# Altium schematic sheet drv8301.SchDoc
size A4; SheetNumber: 4; SheetTotal: 8
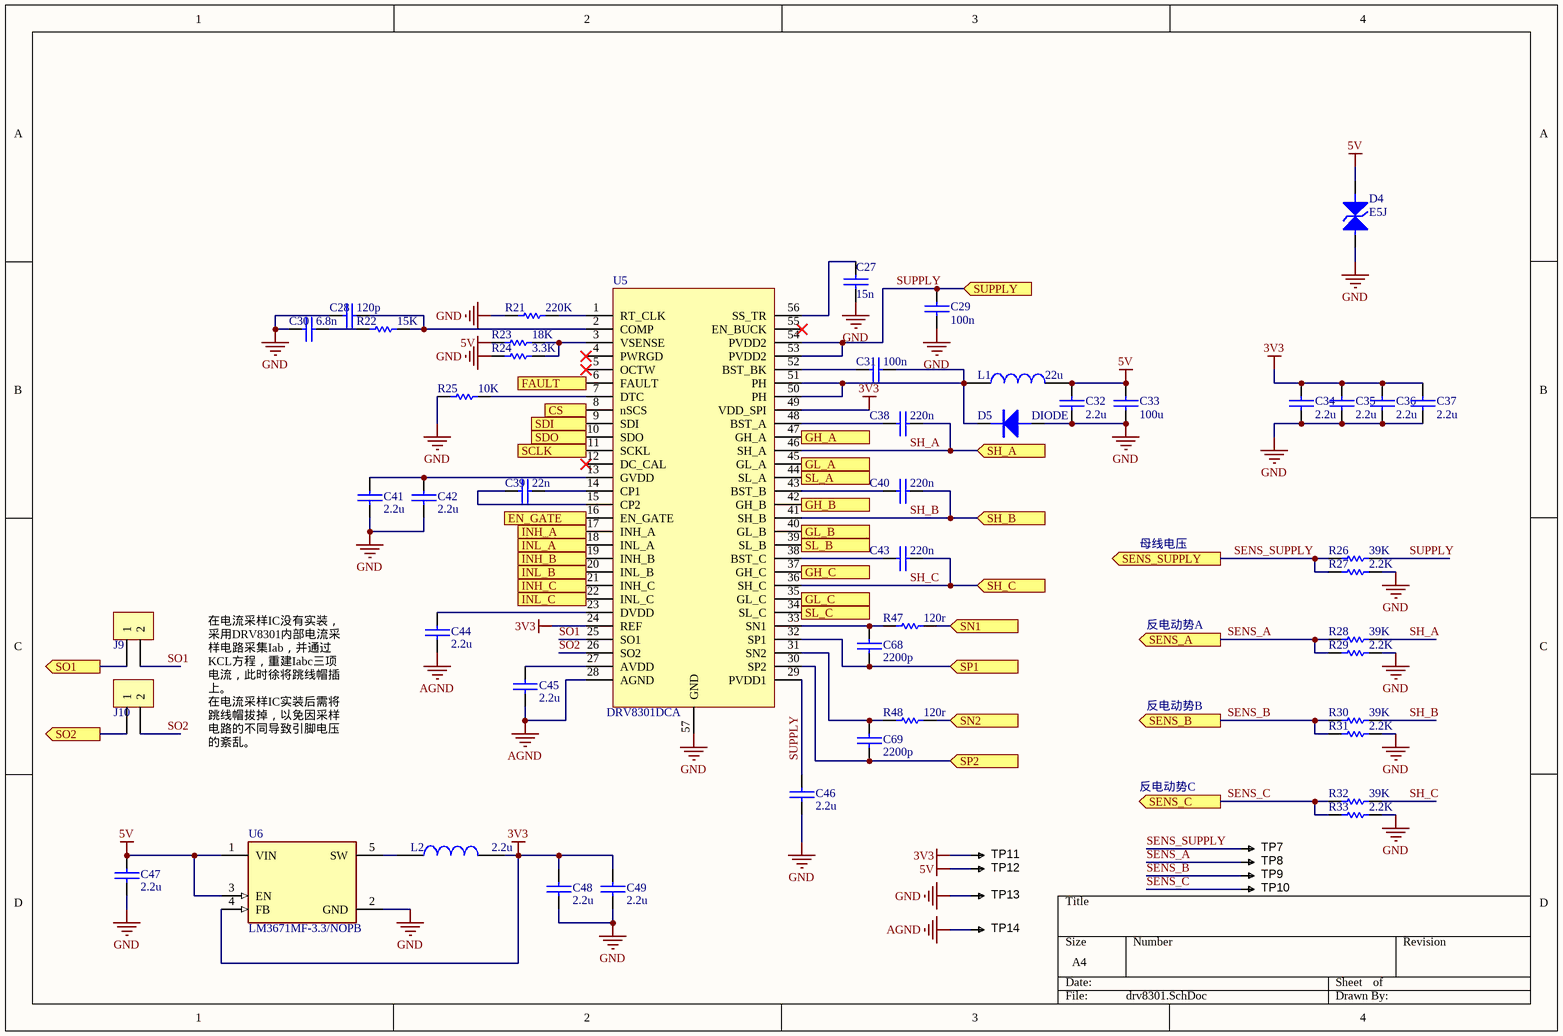
[diagram p0: drv8301.SchDoc]

## Parts
C27  15n  [0603C]
C28  120p  [0603C]
C29  100n  [0603C]
C30  6.8n  [0603C]
C31  100n  [0603C]
C32  2.2u  [0603C]
C33  100u  [0603C]
C34  2.2u  [0603C]
C35  2.2u  [0603C]
C36  2.2u  [0603C]
C37  2.2u  [0603C]
C38  220n  [0603C]
C39  22n  [0603C]
C40  220n  [0603C]
C41  2.2u  [0603C]
C42  2.2u  [0603C]
C43  220n  [0603C]
C44  2.2u  [0603C]
C45  2.2u  [0603C]
C46  2.2u  [0603C]
C47  2.2u  [0603C]
C48  2.2u  [0603C]
C49  2.2u  [0603C]
C68  2200p  [0603C]
C69  2200p  [0603C]
D4  E5J  [SOD-123]
D5  DIODE  [SMA/DO-214AC]
J9  Pin HDR1X2  [Pin HDR1X2/2.54mm-S]  (value not drawn)
J10  Pin HDR1X2  [Pin HDR1X2/2.54mm-S]  (value not drawn)
L1  22u  [0630L]
L2  2.2u  [0630L]
R21  220K  [0603R]
R22  15K  [0603R]
R23  18K  [0603R]
R24  3.3K  [0603R]
R25  10K  [0603R]
R26  39K  [0603R]
R27  2.2K  [0603R]
R28  39K  [0603R]
R29  2.2K  [0603R]
R30  39K  [0603R]
R31  2.2K  [0603R]
R32  39K  [0603R]
R33  2.2K  [0603R]
R47  120r  [0603R]
R48  120r  [0603R]
TP7  TESTPOINT  [FIDUCIAL]  (value not drawn)  (no BOM)
TP8  TESTPOINT  [FIDUCIAL]  (value not drawn)  (no BOM)
TP9  TESTPOINT  [FIDUCIAL]  (value not drawn)  (no BOM)
TP10  TESTPOINT  [FIDUCIAL]  (value not drawn)  (no BOM)
TP11  TESTPOINT  [FIDUCIAL]  (value not drawn)  (no BOM)
TP12  TESTPOINT  [FIDUCIAL]  (value not drawn)  (no BOM)
TP13  TESTPOINT  [FIDUCIAL]  (value not drawn)  (no BOM)
TP14  TESTPOINT  [FIDUCIAL]  (value not drawn)  (no BOM)
U5  DRV8301DCA  [TSSOP50P810X120_HS-57N]
U6  LM3671MF-3.3/NOPB  [FP-DBV0005A-MFG]

## Ports
CS (in), EN_GATE (in), FAULT (out), GH_A (in), GH_B (in), GH_C (in), GL_A (in), GL_B (in), GL_C (in), INH_A (in), INH_B (in), INH_C (in), INL_A (in), INL_B (in), INL_C (in), SCLK (in), SDI (in), SDO (out), SENS_A (out), SENS_B (out), SENS_C (out), SENS_SUPPLY (out), SH_A (in), SH_B (in), SH_C (in), SL_A (in), SL_B (in), SL_C (in), SN1 (in), SN2 (in), SO1 (out), SO2 (out), SP1 (in), SP2 (in), SUPPLY (in)

## Nets
3V3: C34.1 C35.1 C36.1 C37.1 C48.2 C49.2 L2.2 TP11.1 U5.24(REF) U5.49(VDD_SPI) U6.4(FB)
5V: C32.1 C33.1 C47.2 D4.K L1.2 R23.1 TP12.1 U6.1(VIN) U6.3(EN)
AGND: C44.1 C45.1 TP14.1 U5.28(AGND)
GND: C27.2 C28.2 C29.2 C30.2 C32.2 C33.2 C34.2 C35.2 C36.2 C37.2 C41.1 C42.1 C46.1 C47.1 C48.1 C49.1 D4.A D5.A R21.2 R24.2 R25.2 R27.1 R29.1 R31.1 R33.1 TP13.1 U5.57(GND) U6.2(GND)
CS: U5.8(nSCS) ; port CS
EN_GATE: U5.16(EN_GATE) ; port EN_GATE
FAULT: U5.6(FAULT) ; port FAULT
GH_A: U5.47(GH_A) ; port GH_A
GH_B: U5.42(GH_B) ; port GH_B
GH_C: U5.37(GH_C) ; port GH_C
GL_A: U5.45(GL_A) ; port GL_A
GL_B: U5.40(GL_B) ; port GL_B
GL_C: U5.35(GL_C) ; port GL_C
INH_A: U5.17(INH_A) ; port INH_A
INH_B: U5.19(INH_B) ; port INH_B
INH_C: U5.21(INH_C) ; port INH_C
INL_A: U5.18(INL_A) ; port INL_A
INL_B: U5.20(INL_B) ; port INL_B
INL_C: U5.22(INL_C) ; port INL_C
SCLK: U5.11(SCKL) ; port SCLK
SDI: U5.9(SDI) ; port SDI
SDO: U5.10(SDO) ; port SDO
SENS_A: R28.2 R29.2 TP8.1 ; port SENS_A
SENS_B: R30.2 R31.2 TP9.1 ; port SENS_B
SENS_C: R32.2 R33.2 TP10.1 ; port SENS_C
SENS_SUPPLY: R26.2 R27.2 TP7.1 ; port SENS_SUPPLY
SH_A: C38.1 R28.1 U5.46(SH_A) ; port SH_A
SH_B: C40.1 R30.1 U5.41(SH_B) ; port SH_B
SH_C: C43.1 R32.1 U5.36(SH_C) ; port SH_C
SL_A: U5.44(SL_A) ; port SL_A
SL_B: U5.39(SL_B) ; port SL_B
SL_C: U5.34(SL_C) ; port SL_C
SN1: R47.1 ; port SN1
SN2: R48.1 ; port SN2
SO1: J9.2 U5.25(SO1)
SO1: J9.1 ; port SO1  [a separate net that carries the same name]
SO2: J10.2 U5.26(SO2)
SO2: J10.1 ; port SO2  [a separate net that carries the same name]
SP1: C68.1 U5.32(SP1) ; port SP1
SP2: C69.1 U5.30(SP2) ; port SP2
SUPPLY: C29.1 C46.2 R26.1 U5.29(PVDD1) U5.53(PVDD2) U5.54(PVDD2) ; port SUPPLY
NetC27_1: C27.1 U5.56(SS_TR)
NetC28_1: C28.1 R22.1 U5.2(COMP)
NetC30_1: C30.1 R22.2
NetC31_1: C31.1 D5.K L1.1 U5.50(PH) U5.51(PH)
NetC31_2: C31.2 U5.52(BST_BK)
NetC38_2: C38.2 U5.48(BST_A)
NetC39_1: C39.1 U5.14(CP1)
NetC39_2: C39.2 U5.15(CP2)
NetC40_2: C40.2 U5.43(BST_B)
NetC41_2: C41.2 C42.2 U5.13(GVDD)
NetC43_2: C43.2 U5.38(BST_C)
NetC44_2: C44.2 U5.23(DVDD)
NetC45_2: C45.2 U5.27(AVDD)
NetC68_2: C68.2 R47.2 U5.33(SN1)
NetC69_2: C69.2 R48.2 U5.31(SN2)
NetL2_1: L2.1 U6.5(SW)
NetR21_1: R21.1 U5.1(RT_CLK)
NetR23_2: R23.2 R24.1 U5.3(VSENSE)
NetR25_1: R25.1 U5.7(DTC)

Not connected (* = marked no-connect by the designer): U5 4(PWRGD)* 5(OCTW)* 12(DC_CAL)* 55(EN_BUCK)*

## Notes on the sheet
- 母线电压
- 反电动势A
- 反电动势B
- 在电流采样IC没有实装，采用DRV8301内部电流采样电路采集Iab，并通过KCL方程，重建Iabc三项电流，此时徐将跳线帽插上。
  在电流采样IC实装后需将跳线帽拔掉，以免因采样电路的不同导致引脚电压的紊乱。
- 反电动势C

## Library data of the parts
C27-C49 C68 C69 = CAP: 无极性电容
D4 = TVS: 双向瞬态抑制二极管
D5 = DIODE: 普通二极管
L1 L2 = INDUCTOR
R21-R33 R47 R48 = RES
TP7-TP14 = TESTPOINT: SMD test pin
U6 = CMP-0063-01132-4: IC REG BUCK 3.3V 600MA SOT23-5; Number of Outputs: 1; Min Supply Voltage: 2.7V; Frequency: 2MHz; Min Output Voltage: 1.1V; Max Supply Voltage: 5.5V; Output Type: Fixed; Switching Frequency: 2.6MHz; Quiescent Current: 16uA; Case/Package: SOT-23; Number of Pins: 5; Lead Free: Lead Free; Min Operating Temperature: -40°C; Length: 2.92mm; Packaging: Tape and Reel; Max Output Current: 600mA; Height: 1.02mm; Max Operating Temperature: 85°C; Mount: Surface Mount; REACH SVHC: No SVHC; Contact Plating: Tin; Output Current: 600mA; Min Input Voltage: 2.7V; RoHS Compliant: Yes; Output Voltage: 3.3V; Package Quantity: 1000; Max Output Voltage: 3.3V; Nominal Output Voltage: 3.3V; Width: 1.6mm; Max Input Voltage: 5.5V; Termination: SMD/SMT